# EAGLE design DataFlash (EAGLE 7.6.0)
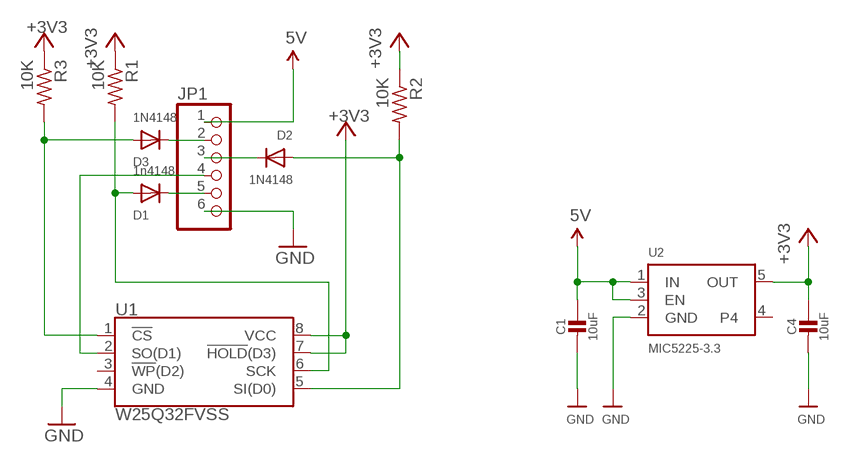
[diagram p0: schematic, sheet 1]

## Parts
C1  10uF  CAP_CERAMIC0805-NOOUTLINE  [0805-NO]
C4  10uF  CAP_CERAMIC0805-NOOUTLINE  [0805-NO]
D1  1n4148  DIODESOD-323F  [SOD-323F]
D2  1N4148  DIODESOD-323F  [SOD-323F]
D3  1N4148  DIODESOD-323F  [SOD-323F]
JP1  HEADER-1X6ROUND  [1X06_ROUND]
R1  10K  R-US_R0805  [R0805]
R2  10K  R-US_R0805  [R0805]
R3  10K  R-US_R0805  [R0805]
U1  W25Q32FVSS  [SOIC-8]
U2  MIC5225-3.3  VREG_SOT23-5  [SOT23-5]

## Nets
5V: C1.1 JP1.1 U2.1(IN) U2.3(EN)
+3V3: C4.1 R1.1 R2.1 R3.1 U1.7(!HOLD!(D3)) U1.8(VCC) U2.5(OUT)
GND [gnd]: C1.2 C4.2 JP1.6 U1.4(GND) U2.2(GND)
N$2: D2.C JP1.3
N$3: D1.C JP1.5
N$4: D2.A R2.2 U1.5(SI(D0))
N$6: D3.C JP1.2
N$7: D3.A R3.2 U1.1(!CS!)
PB11_S4_SPI_SCK: D1.A R1.2 U1.6(SCK)
PB12_S4_SPI_MISO: JP1.4 U1.2(SO(D1))
Unconnected: U1.3(!WP!(D2)) U2.4

## Library data of the parts
C1 C4 = microbuilder:CAP_CERAMIC: Ceramic Capacitors For new designs, use the packages preceded by an '_' character since they are more reliable: The following footprints should be used on most boards: _0402 - Standard footprint for regular board layouts _0603 - Standard footprint for regular board layouts _0805 - Standard footprint for regular board layouts _1206 - Standard footprint for regular board layouts For extremely tight-pitch boards where space is at a premium, the following 'micro-pitch' footprints can be used (smaller pads, no silkscreen outline, etc.): _0402MP - Micro-pitch footprint for very dense/compact boards _0603MP - Micro-pitch footprint for very dense/compact boards _0805MP - Micro-pitch footprint for very dense/compact boards _1206MP - Micro-pitch footprint for very dense/compact boards
D1-D3 = adafruit:DIODE: Diode SMADIODE - SMA Surface Mount Package 20V 1A Schottky Diode Digikey: 641-1014-6-ND DO-1N4148 - Through Hole Small Current Diode SOD-123 20V 1 A (.5mV Vf) Schottky Diode - Digikey: MBRX120TPMSCT-ND SOD-323 10V 570mA (.38mV Vf, 3ns) Schottky Diode - Digikey: ZLLS410CT-ND SOD-523 30V 30mA Schottky Diode (RB751S-40TE61) - Digikey: RB751S-40TE61CT-ND SOT23-R/W - SOT23 Package (R = Solder Paste/Reflow Ovens, W = Hand-Soldering) BAT54Film 40V 300mA - Digikey: 497-7162-1-ND
JP1 = microbuilder:HEADER-1X6: PIN HEADER
R1-R3 = adafruit:R-US_: RESISTOR, American symbol
U1 = SparkFun-DigitalIC:W25Q32FV: Winbond W25Q32FV 32Mbit (4MB) Flash The W25Q32FV support the standard Serial Peripheral Interface (SPI), Dual/Quad I/O SPI as well as 2-clocks instruction cycle Quad Peripheral Interface (QPI). Datasheet <http://www.winbond.com/resource-files/w25q32fv%20revh%20091613.pdf>; PROD_ID: IC-13229
U2 = microbuilder:VREG_SOT23-5: SOT23-5 Fixed Voltage Regulators Part Current Out V Out V In V Dropout θJA (°C/W) TJ (°C) Digikey Part No. ADP121 150mA 3.3V 3.4-5.5V 0.09V @ 150mA -- -- ADP121-AUJZ33R7CT-ND ADP121 150mA 3.0V 3.1-5.5V 0.09V @ 150mA -- -- ADP121-AUJZ30R7CT-ND ADP122 300mA 3.3V 3.4-5.5V 0.085V @ 300mA -- -- ADP122AUJZ-3.3-R7CT-ND ADP1712 300mA 3.3V 3.5-5.5V 0.17V @ 300mA -- -- ADP1712AUJZ-3.3-R7TR-ND AP7311 (Low Cost) 150mA 3.3V 3.5-6V 0.15V @ 150mA -- -- AP7311-33WG-7DICT-ND LD39015M18R 150mA 1.8V 1.9V-5.5V 0.08V @ 100mA -- -- 497-6977-1-ND LP2985A-33DBVR 150mA 3.3V 3.3-16V 0.28V @ 150mA 206 150 296-18479-1-ND MCP1824T-3302E/OT 300mA 3.3V 3.5V-6V 0.2V @ 300mA -- -- MCP1824T-3302E/OTCT-ND MIC5205-2.5YM5 TR 150mA 2.5V 2.7-16V 0.165V @ 150mA -- -- 576-1257-2-ND MIC5205-3.0YM5 TR 150mA 3.0V 3.2V-16V 0.165V @ 150mA -- -- 576-1258-2-ND MIC5205-3.3YM5 TR 150mA 3.3V 3.5V-16V 0.165V @ 150mA -- -- 576-1259-2-ND TPS780330220 150mA 3.3V+2.2V 3.6-5.5V 250mV Max -- -- 296-23332-1-ND TDA3663/N1,135 100mA 3.3V 3.5-45V 0.18V @ 50mA -- -- 568-5343-1-ND Max operating temp can be calculated using θJA, TJ (max junction temperature), and power in watts. Set the "Maximum Ambient Temperature" until it reaches TJ ("Max Junction Temperature"), which is the absolute limit for safe use of the regulator: Heat Sink Temperature Calculator <http://www.daycounter.com/Calculators/Heat-Sink-Temperature-Calculator.phtml> For example, With 12V source into a 3.3V LP2985 and a 30mA load, we are dissipating (12V-3.3V) * 0.03A = 0.261W. With a θJA of 206 °C/W, a TJ of 150°C, and 261mW we can safely use the chip without a heat sink up to 75°C (=147.1°C Junction Temperature).

## Net classes
0 default: width 0.102 mm, drill 0.1 mm
1 USB: width 0.102 mm, drill 0.1 mm
2 gnd: width 0.102 mm, drill 0.1 mm
3 usbvcc: width 0.102 mm, drill 0.1 mm, clearance 0.15 mm
4 USBpair: width 0.102 mm, drill 0.1 mm, clearance 0.15 mm to class 3

## Board
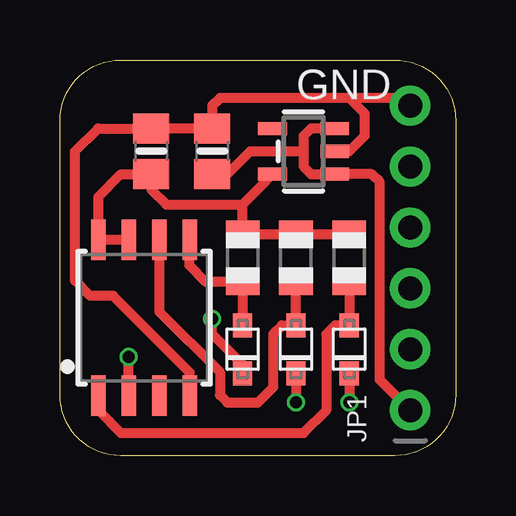
[diagram p1: board, top side]
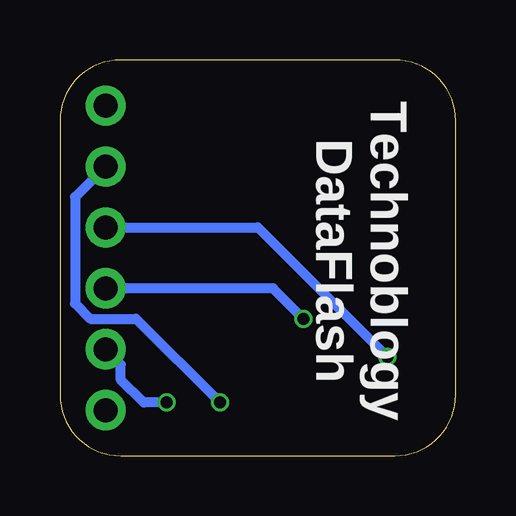
[diagram p2: board, bottom side, seen from below]

Size 16.51 x 16.51 mm. Coordinates in mm from the lower left corner, seen from the top.
Outline: 0,13.97 arc-90 2.54,16.51 13.97,16.51 arc-90 16.51,13.97 16.51,2.54 arc-90 13.97,0 2.54,0 arc-90 0,2.54 0,13.97
Copper layers (1*16): Top 0.035mm / dielectric 1.5mm / Bottom 0.035mm
Design rules "eC_4Layer_PClass6_BaseCopperO35-I35 *": minimum track width 0.1mm, minimum drill 0.2mm, track to track 0.15mm, track to pad 0.15mm, pad to pad 0.15mm, via to via 0.15mm, smd to smd 0mil, copper to edge 0.25mm, drill to drill 0.35mm, minimum pad ring 0.175mm, minimum via ring 0.125mm, stop-mask expansion 4mil, vias tented up to drill 20mil, thermal gap 0.2mm

### Footprints (pad centres in the part's own frame; a part is rotated, then mirrored left to right if it is on the bottom)
0805-NO = smd 1.24 x 1.5: 1 -0.95,0; 2 0.95,0
SOD-323F = smd 1 x 0.8: A -1,0; C 1,0
1X06_ROUND = drill 1 pad 1.676: 1 -6.35,0; 2 -3.81,0; 3 -1.27,0; 4 1.27,0; 5 3.81,0; 6 6.35,0
R0805 = smd 1.1 x 1.4: 1 -1,0; 2 1,0
SOIC-8 = smd 0.61 x 1.702: 1 -1.905,-3.251; 2 -0.635,-3.251; 3 0.635,-3.251; 4 1.905,-3.251; 5 1.905,3.251; 6 0.635,3.251; 7 -0.635,3.251; 8 -1.905,3.251
SOT23-5 = smd 0.55 x 1.2: 1 -0.95,-1.3; 2 0,-1.3; 3 0.95,-1.3; 4 0.95,1.3; 5 -0.95,1.3

### Placement (x,y rotation side)
C1  6.35,12.7 90 top
C4  3.81,12.7 90 top
D1  9.84,4.45 270 top
D2  7.62,4.45 270 top
D3  12.06,4.45 270 top
JP1  14.61,8.26 90 top
R1  9.84,8.26 270 top
R2  7.62,8.26 270 top
R3  12.06,8.26 270 top
U1  3.51,5.76 0 top
U2  10.16,12.7 90 top

### Tracks (layer width: path | path; a pad name or v marks a point on that pad's centre or on a via)
5V
  Top 0.406: U2.3 10.47,13.65 10.16,13.34 10.16,12.7 | 10.16,12.7 10.16,12.06 10.48,11.75 U2.1 | U2.1 11.74,11.75 | 10.16,12.7 7.94,12.7 6.99,11.75 C1.1 | JP1.1 13.34,3.17 13.34,11.43 13.02,11.75 U2.1
+3V3
  Top 0.406: 8.78,11.67 U2.5 8.57,11.46 8.57,11.43 7.62,10.48 | 7.62,10.48 R2.1 R1.1 R3.1 | 7.62,10.48 4.45,10.48 3.81,11.11 C4.1 4.12,11.75 2.54,11.75 1.6,10.81 U1.8 U1.7
GND
  Top 0.406: 12.06,14.92 12.7,14.29 12.7,13.34 12.06,12.7 U2.2 | 5.42,2.21 U1.4 5.42,3.48 2.22,6.67 1.27,6.67 0.64,7.3 0.64,12.7 1.59,13.65 4.12,13.65 C4.2 C1.2 6.35,14.61 6.67,14.92 12.06,14.92 | JP1.6 14.29,14.61 13.97,14.92 12.06,14.92
N$2  (via drill 0.5)
  Top 0.406: D2.C 7.62,3.81 6.35,5.08 v6.35,5.71
  Bottom 0.406: v6.35,5.71 7.62,6.99 JP1.3
N$3  (via drill 0.5)
  Top 0.406: D1.C v9.84,2.22
  Bottom 0.406: JP1.5 15.88,10.79 15.88,6.35 15.24,5.71 13.34,5.71 v9.84,2.22
N$4
  Top 0.406: D2.A R2.2 6.08,7.25 5.4,7.94 5.4,9 U1.5
N$6  (via drill 0.5)
  Top 0.406: D3.C v12.06,2.22
  Bottom 0.406: v12.06,2.22 13.02,2.22 13.97,3.17 13.97,3.81 JP1.2
N$7
  Top 0.406: U1.1 1.6,1.89 2.54,0.95 10.16,0.95 11.11,1.91 11.11,5.08 11.48,5.45 D3.A R3.2
PB11_S4_SPI_SCK
  Top 0.406: U1.6 4.14,6.02 6.67,3.49 6.67,2.54 6.99,2.22 8.26,2.22 8.89,2.86 8.89,5.08 9.26,5.45 D1.A R1.2
PB12_S4_SPI_MISO  (via drill 0.5)
  Top 0.406: U1.2 2.86,2.53 v2.86,4.13
  Bottom 0.406: v2.86,4.13 8.26,9.53 JP1.4

### Text on the board
tPlace: GND
bNames: Technoblogy / DataFlash